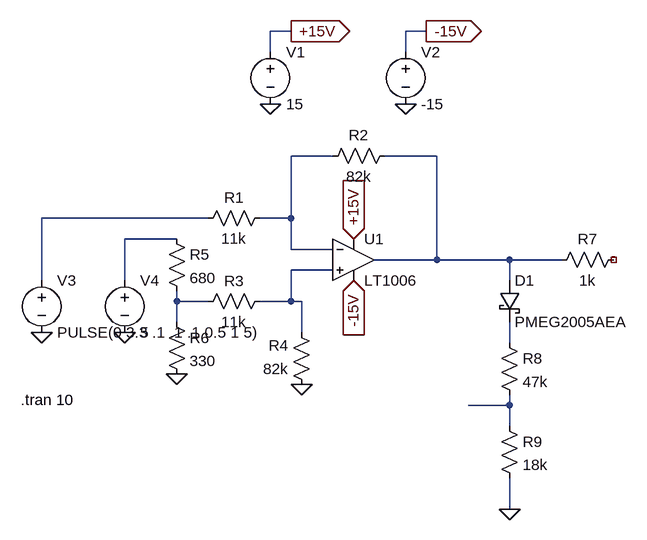
[diagram p0: schematic pil.asc]
pil.asc, the LTspice schematic file:
Version 4
SHEET 1 880 804
WIRE 80 48 48 48
WIRE 288 48 256 48
WIRE 48 80 48 48
WIRE 256 80 256 48
WIRE 144 240 80 240
WIRE 304 240 224 240
WIRE -48 336 -304 336
WIRE 80 336 80 240
WIRE 80 336 32 336
WIRE -96 368 -176 368
WIRE 80 384 80 336
WIRE 144 384 80 384
WIRE 304 400 304 240
WIRE 304 400 208 400
WIRE 416 400 304 400
WIRE 496 400 416 400
WIRE 144 416 80 416
WIRE -304 432 -304 336
WIRE -176 432 -176 368
WIRE 416 432 416 400
WIRE -96 464 -96 448
WIRE -48 464 -96 464
WIRE 80 464 80 416
WIRE 80 464 32 464
WIRE 96 464 80 464
WIRE -96 496 -96 464
WIRE 96 512 96 464
WIRE 416 528 416 496
WIRE 416 624 416 608
WIRE 416 624 352 624
WIRE 416 656 416 624
WIRE 416 784 416 736
FLAG 80 48 +15V
IOPIN 80 48 Out
FLAG 288 48 -15V
IOPIN 288 48 Out
FLAG 48 160 0
FLAG 256 160 0
FLAG 176 368 +15V
IOPIN 176 368 In
FLAG 176 432 -15V
IOPIN 176 432 In
FLAG -304 512 0
FLAG 96 592 0
FLAG -96 576 0
FLAG -176 512 0
FLAG 416 784 0
DATAFLAG 384 624 ""
SYMBOL voltage 48 64 R0
WINDOW 123 0 0 Left 0
WINDOW 39 0 0 Left 0
SYMATTR InstName V1
SYMATTR Value 15
SYMBOL voltage 256 64 R0
WINDOW 123 0 0 Left 0
WINDOW 39 0 0 Left 0
SYMATTR InstName V2
SYMATTR Value -15
SYMBOL OpAmps\\LT1006 176 336 R0
SYMATTR InstName U1
SYMBOL res 48 320 R90
WINDOW 0 0 56 VBottom 2
WINDOW 3 32 56 VTop 2
SYMATTR InstName R1
SYMATTR Value 11k
SYMBOL res 240 224 R90
WINDOW 0 0 56 VBottom 2
WINDOW 3 32 56 VTop 2
SYMATTR InstName R2
SYMATTR Value 82k
SYMBOL res 48 448 R90
WINDOW 0 0 56 VBottom 2
WINDOW 3 32 56 VTop 2
SYMATTR InstName R3
SYMATTR Value 11k
SYMBOL res 112 608 R180
WINDOW 0 36 76 Left 2
WINDOW 3 36 40 Left 2
SYMATTR InstName R4
SYMATTR Value 82k
SYMBOL voltage -304 416 R0
WINDOW 123 0 0 Left 0
WINDOW 39 0 0 Left 0
SYMATTR InstName V3
SYMATTR Value PULSE(0 3.3 .1 .1 .1 0.5 1 5)
SYMBOL res -112 352 R0
SYMATTR InstName R5
SYMATTR Value 680
SYMBOL res -112 480 R0
SYMATTR InstName R6
SYMATTR Value 330
SYMBOL voltage -176 416 R0
WINDOW 123 0 0 Left 0
WINDOW 39 0 0 Left 0
SYMATTR InstName V4
SYMATTR Value 5
SYMBOL res 592 384 R90
WINDOW 0 0 56 VBottom 2
WINDOW 3 32 56 VTop 2
SYMATTR InstName R7
SYMATTR Value 1k
SYMBOL schottky 400 432 R0
SYMATTR InstName D1
SYMATTR Value PMEG2005AEA
SYMATTR Description Diode
SYMATTR Type diode
SYMBOL res 400 512 R0
SYMATTR InstName R8
SYMATTR Value 47k
SYMBOL res 400 640 R0
SYMATTR InstName R9
SYMATTR Value 18k
TEXT -336 616 Left 2 !.tran 10

The netlist it stands for:
* pil.asc
V1 +15V 0 15
V2 -15V 0 -15
XU1 N005 N001 +15V -15V N002 LT1006  ; pins In+ In- V+ V- OUT
R1 N001 N003 11k
R2 N002 N001 82k
R3 N005 N006 11k
R4 0 N005 82k
V3 N003 0 PULSE(0 3.3 .1 .1 .1 0.5 1 5)
R5 N004 N006 680
R6 N006 0 330
V4 N004 0 5
R7 NC_01 N002 1k
D1 N002 N007 PMEG2005AEA
R8 N007 N008 47k
R9 N008 0 18k
.model D D
.lib standard.dio
.tran 10
.lib LTC.lib
.backanno
.end